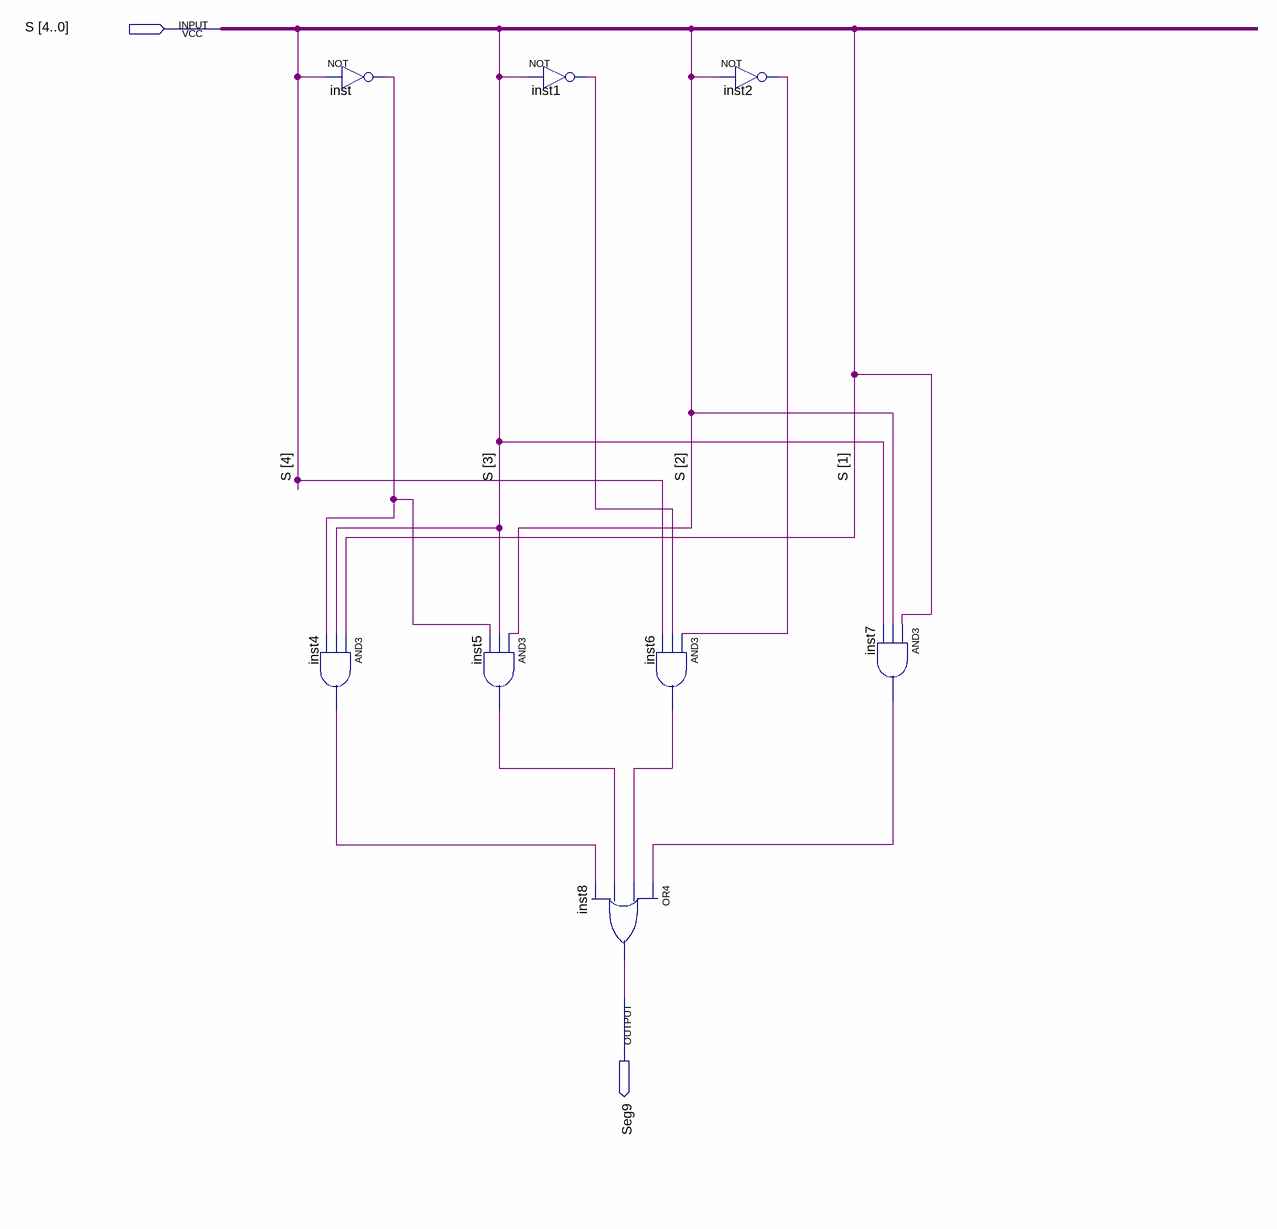
[diagram p0: schematic sheet]
// Quartus schematic Seg9.bdf as structural Verilog: 8 symbols, 2 pins
module Seg9 (
  input  [4:0] S,
  output Seg9
);

  wire inst1_out, inst2_out, inst4_out, inst5_out, inst6_out, inst7_out, inst_out;

  not inst (inst_out, S[4]);
  and inst4 (inst4_out, S[1], S[3], inst_out);
  and inst5 (inst5_out, S[2], S[3], inst_out);
  not inst1 (inst1_out, S[3]);
  or inst8 (Seg9, inst7_out, inst6_out, inst5_out, inst4_out);
  and inst6 (inst6_out, inst2_out, inst1_out, S[4]);
  not inst2 (inst2_out, S[2]);
  and inst7 (inst7_out, S[1], S[2], S[3]);
endmodule
